# Altium schematic sheet RS485 Com and Connectors.SchDoc
size A4; SheetNumber: 3; SheetTotal: 7
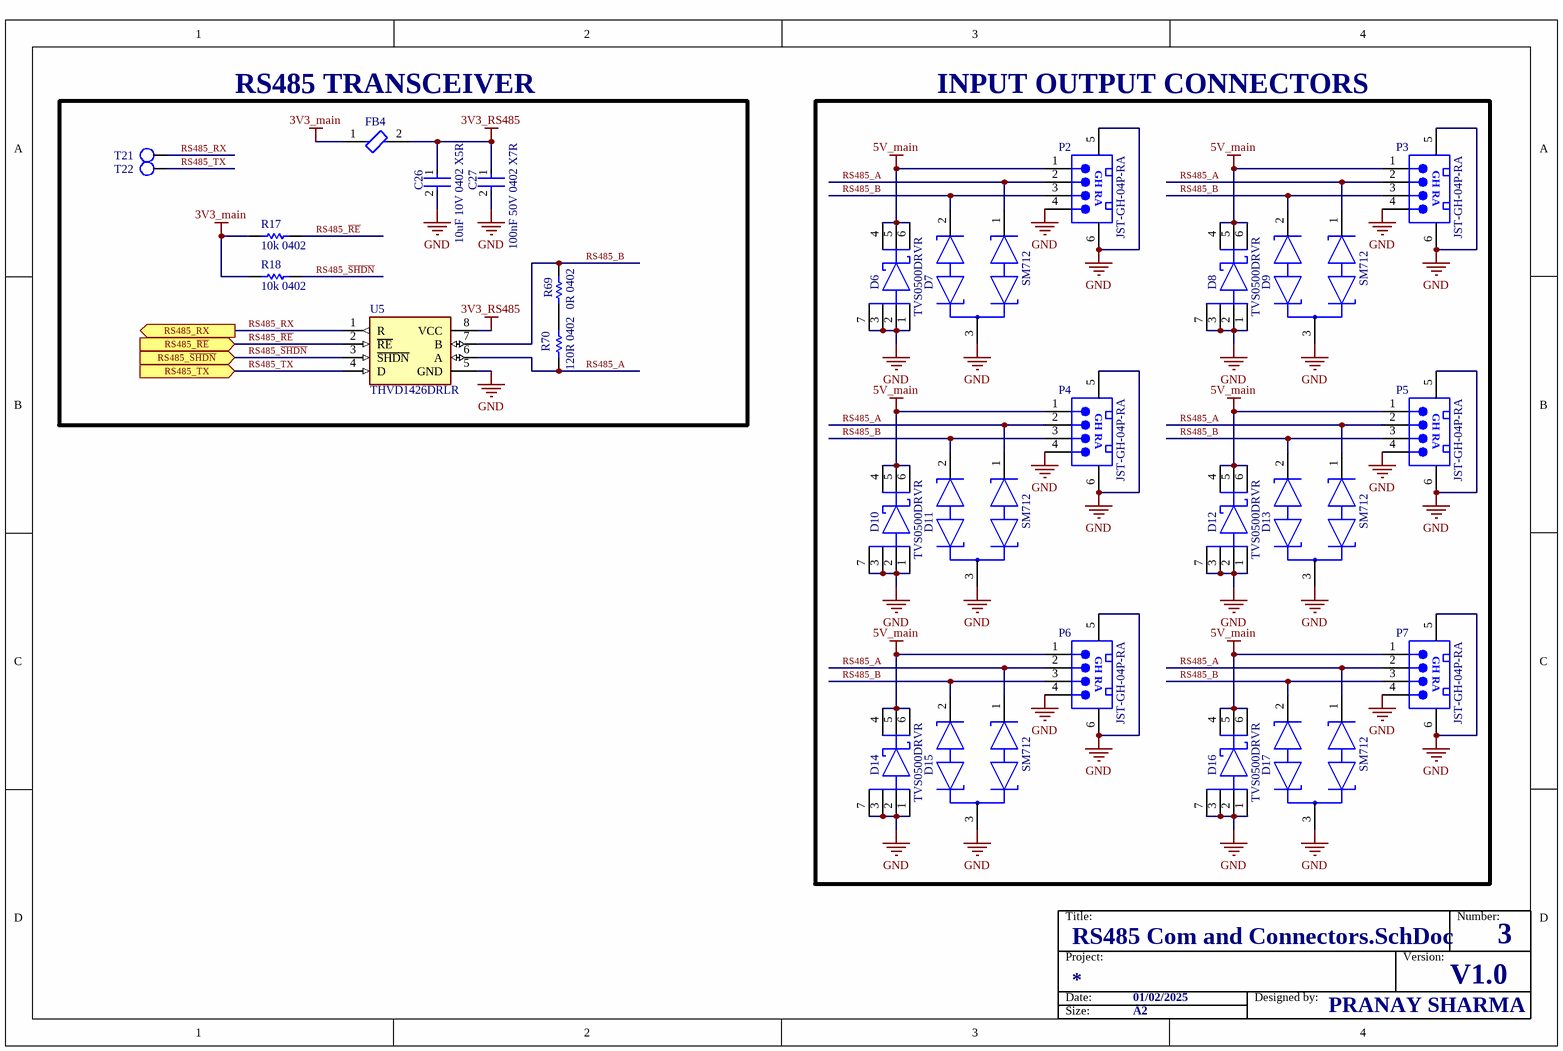
[diagram p0: RS485 Com and Connectors.SchDoc]

## Parts
C26  10uF 10V 0402 X5R  [0402 IPC CLASS C CAPACITOR]
C27  100nF 50V 0402 X7R  [0402 IPC CLASS C CAPACITOR]
D6  TVS0500DRVR  [DRV0006A IPC-C]
D7  SM712  [FP-SOT23-IPC_C]
D8  TVS0500DRVR  [DRV0006A IPC-C]
D9  SM712  [FP-SOT23-IPC_C]
D10  TVS0500DRVR  [DRV0006A IPC-C]
D11  SM712  [FP-SOT23-IPC_C]
D12  TVS0500DRVR  [DRV0006A IPC-C]
D13  SM712  [FP-SOT23-IPC_C]
D14  TVS0500DRVR  [DRV0006A IPC-C]
D15  SM712  [FP-SOT23-IPC_C]
D16  TVS0500DRVR  [DRV0006A IPC-C]
D17  SM712  [FP-SOT23-IPC_C]
FB4  BLM15AX102SN1D  [0402 IPC CLASS C FERRITE BEAD]  (value not drawn)
P2  JST-GH-04P-RA  [JST-GH-04P-RA]
P3  JST-GH-04P-RA  [JST-GH-04P-RA]
P4  JST-GH-04P-RA  [JST-GH-04P-RA]
P5  JST-GH-04P-RA  [JST-GH-04P-RA]
P6  JST-GH-04P-RA  [JST-GH-04P-RA]
P7  JST-GH-04P-RA  [JST-GH-04P-RA]
R17  10k 0402  [0402 IPC CLASS C RESISTOR]
R18  10k 0402  [0402 IPC CLASS C RESISTOR]
R69  0R 0402  [0402 IPC CLASS B RESISTOR]
R70  120R 0402  [0402 IPC CLASS C RESISTOR]
T21  TP  [Testpoint1]  (value not drawn)  (no BOM)
T22  TP  [Testpoint1]  (value not drawn)  (no BOM)
U5  THVD1426DRLR  [DRL0008A IPC-C]

## Blocks framed on the sheet
RS485 TRANSCEIVER: C26 C27 FB4 R17 R18 R69 R70 T21 T22 U5
INPUT OUTPUT CONNECTORS: D6-D17 P2-P7

## Ports
RS485_RX (out), RS485_TX (in), RS485_~{RE} (in), RS485_~{SHDN} (in)

## Nets
3V3_main: FB4.1 R17.2 R18.2
3V3_RS485: C26.1 C27.1 FB4.2 U5.8(VCC)
5V_main: D6.4 D6.5 D6.6 D8.4 D8.5 D8.6 D10.4 D10.5 D10.6 D12.4 D12.5 D12.6 D14.4 D14.5 D14.6 D16.4 D16.5 D16.6 P2.1 P3.1 P4.1 P5.1 P6.1 P7.1
GND: C26.2 C27.2 D6.1(C) D6.2(A) D6.3 D6.7 D7.3(CC) D8.1(C) D8.2(A) D8.3 D8.7 D9.3(CC) D10.1(C) D10.2(A) D10.3 D10.7 D11.3(CC) D12.1(C) D12.2(A) D12.3 D12.7 D13.3(CC) D14.1(C) D14.2(A) D14.3 D14.7 D15.3(CC) D16.1(C) D16.2(A) D16.3 D16.7 D17.3(CC) P2.4 P2.5 P2.6 P3.4 P3.5 P3.6 P4.4 P4.5 P4.6 P5.4 P5.5 P5.6 P6.4 P6.5 P6.6 P7.4 P7.5 P7.6 U5.5(GND)
RS485_A: D7.1(K1) D9.1(K1) D11.1(K1) D13.1(K1) D15.1(K1) D17.1(K1) P2.2 P3.2 P4.2 P5.2 P6.2 P7.2 R70.1 U5.6(A)
RS485_B: D7.2(K2) D9.2(K2) D11.2(K2) D13.2(K2) D15.2(K2) D17.2(K2) P2.3 P3.3 P4.3 P5.3 P6.3 P7.3 R69.2 U5.7(B)
RS485_~{RE}: R17.1 U5.2(~{RE}) ; port RS485_~{RE}
RS485_RX: T21.0 U5.1(R) ; port RS485_RX
RS485_~{SHDN}: R18.1 U5.3(~{SHDN}) ; port RS485_~{SHDN}
RS485_TX: T22.0 U5.4(D) ; port RS485_TX
NetR69_1: R69.1 R70.2

## Notes on the sheet
- Title:
- Number:
- Date:
- Project:
- 01/02/2025
- Designed by:
- Version:
- V1.0
- Size:
- A2
- PRANAY SHARMA
- (in symbol JST-GH-04P-RA) GH RA

## Library data of the parts
R17 R18 = 10k 1% 0402
R69 = 0R 1% 0402
R70 = 120R 1% 0402
T21 T22 = Testpoint1